# Altium schematic sheet 25 TEMPORARY DEVIATIONS.SchDoc
size 513 x 386 mm
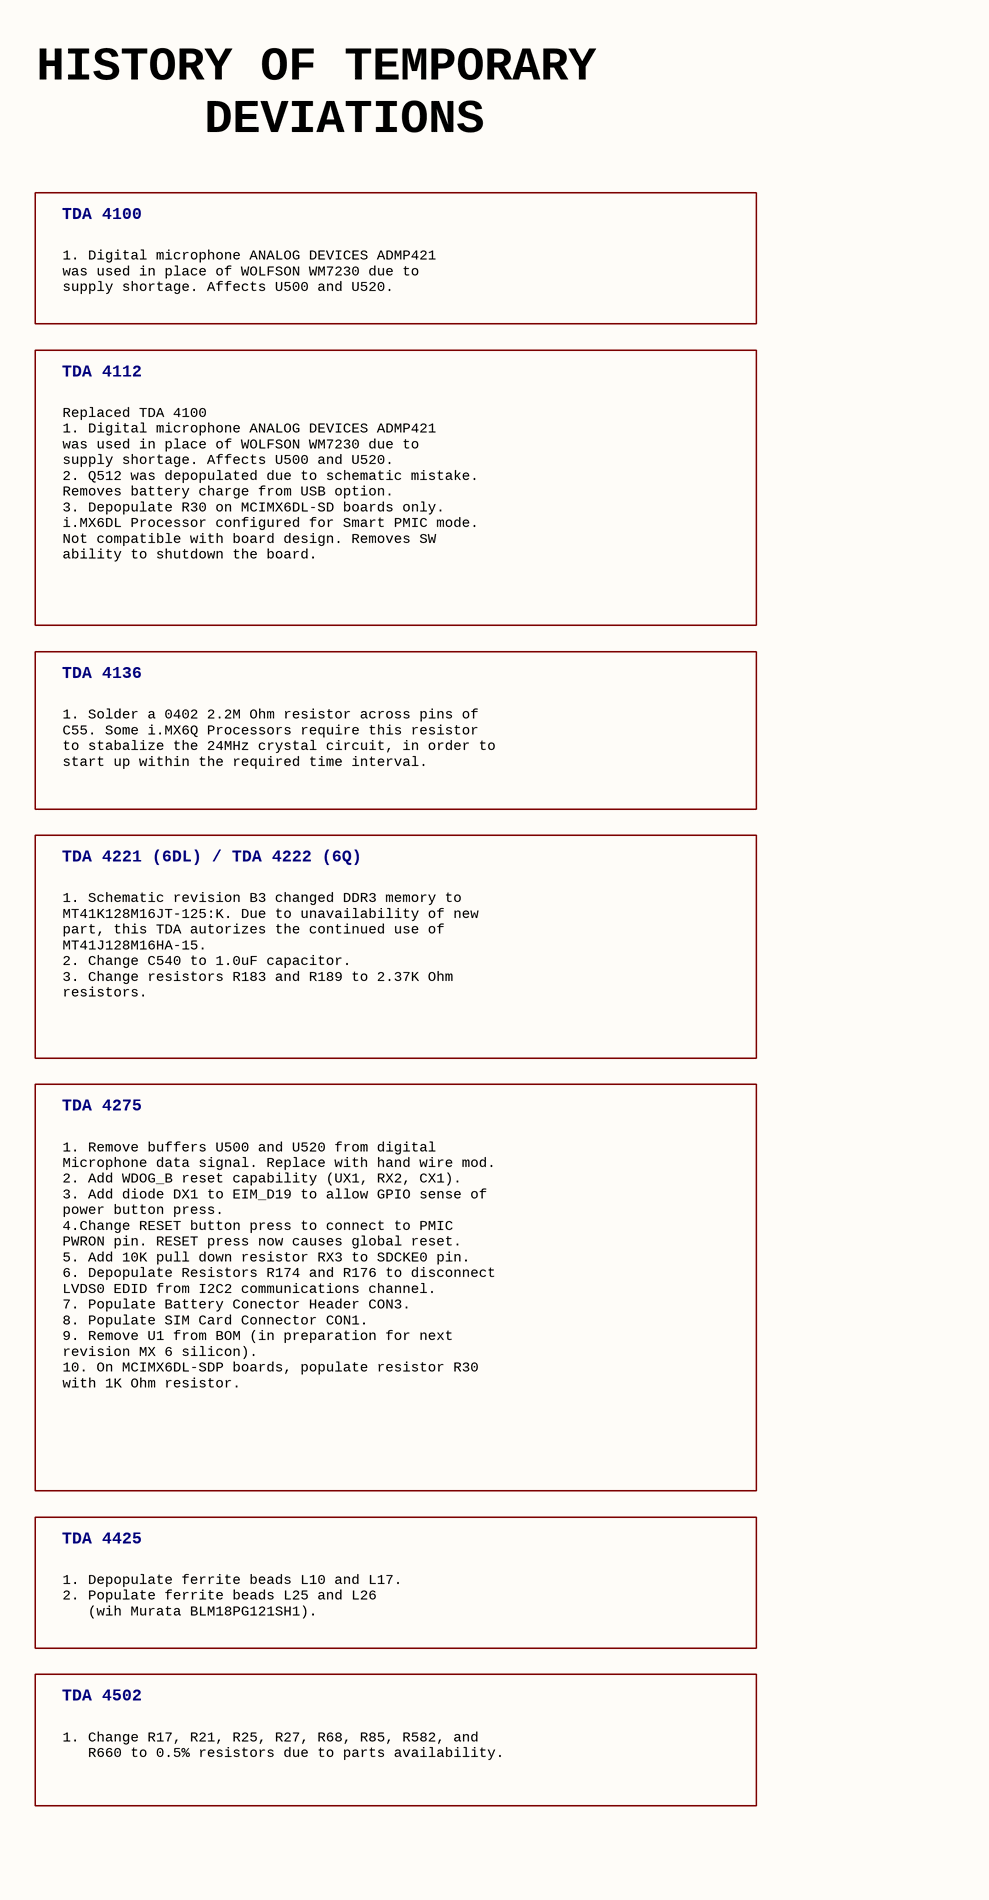
[diagram p0: 25 TEMPORARY DEVIATIONS.SchDoc, left]
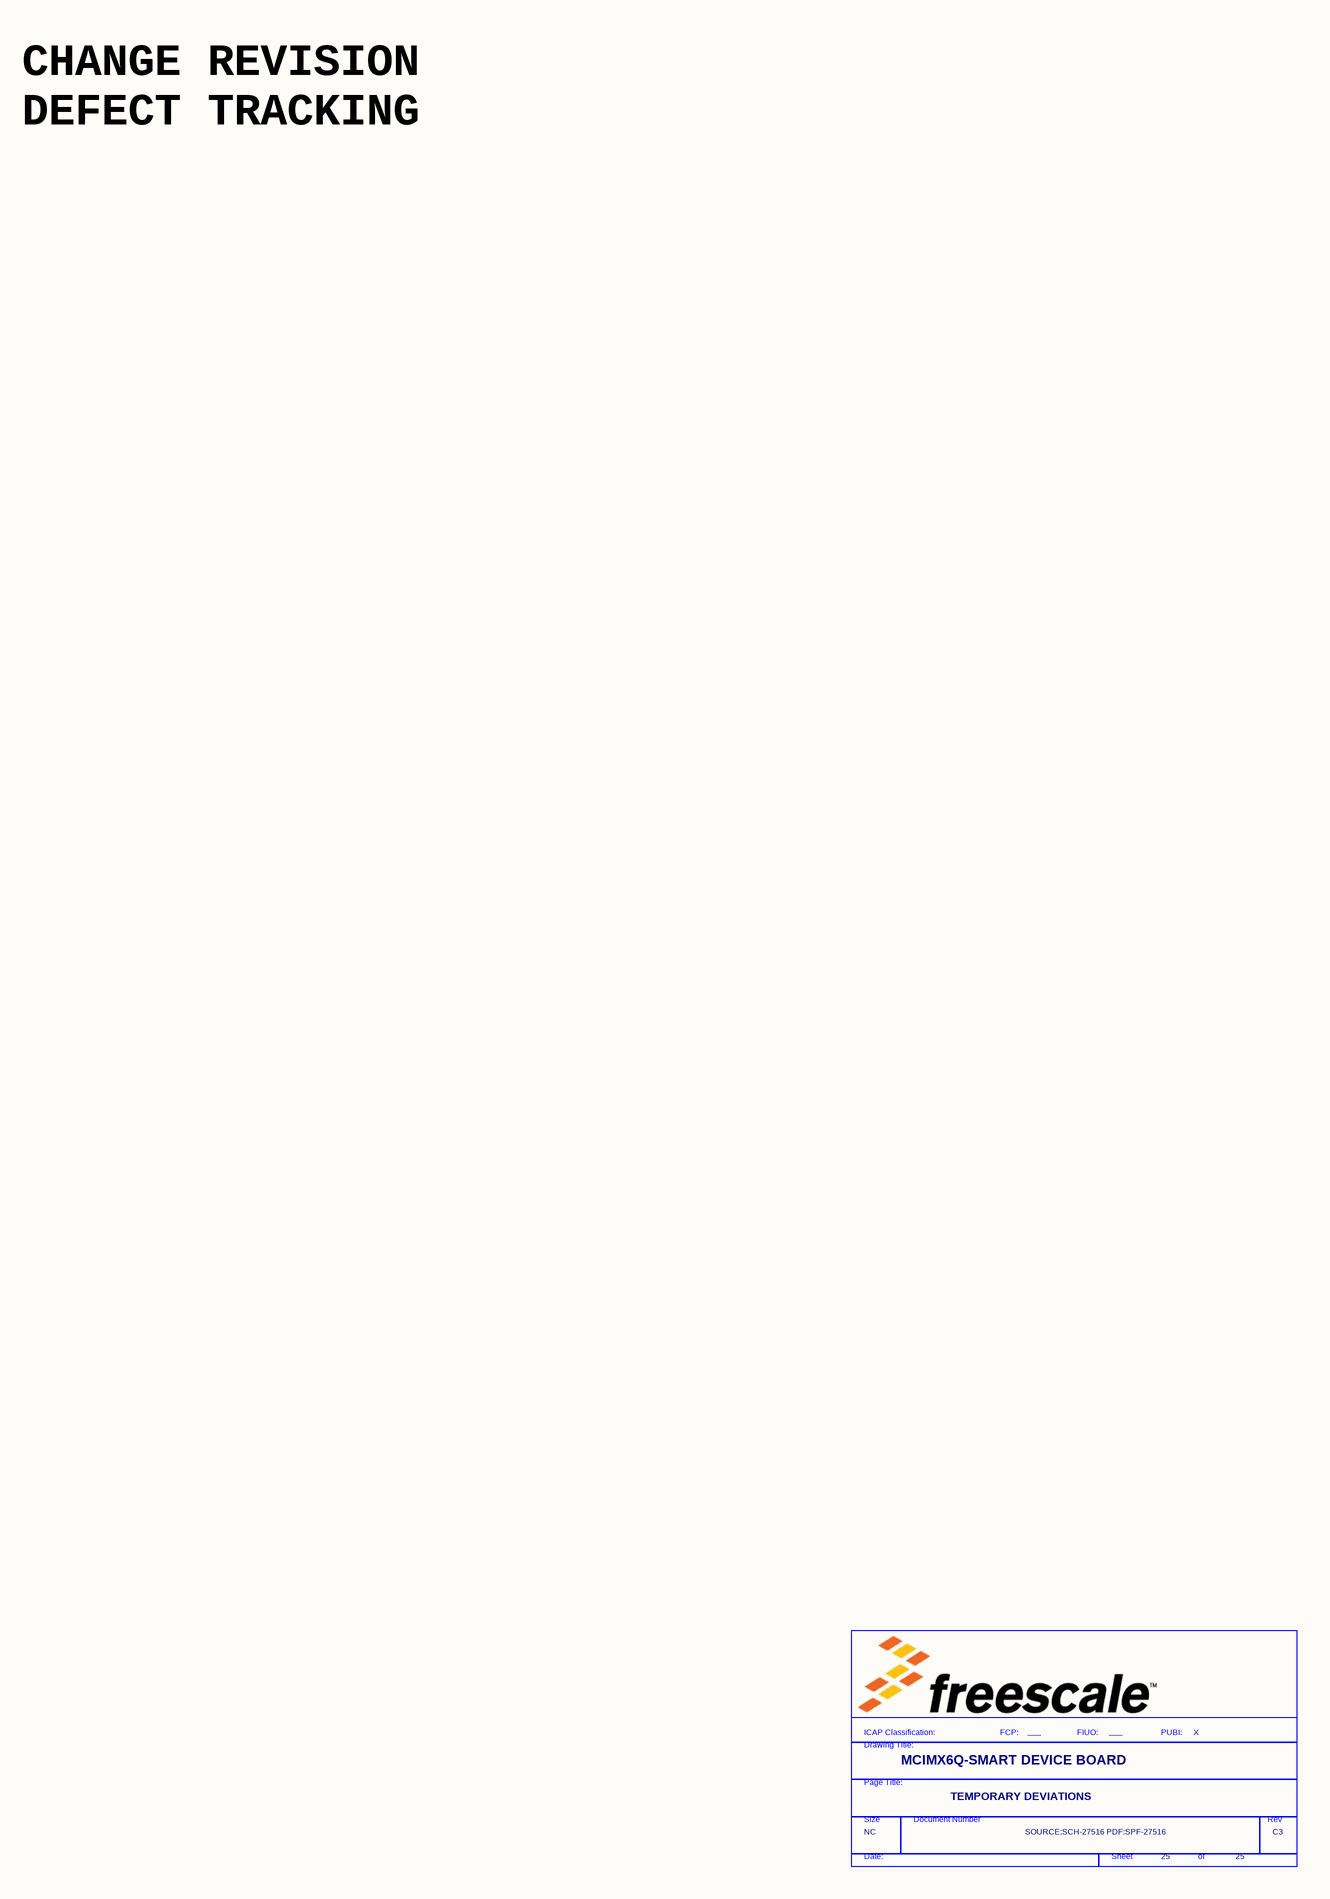
[diagram p1: 25 TEMPORARY DEVIATIONS.SchDoc, right]

## Parts
*  FIUO: ___  PUBI: X  Doc: SOURCE:SCH-27516 PDF:SPF-27516  RevCode: C3  Title: MCIMX6Q-SMART DEVICE BOARD  Page Size: NC  Page Number: 25  PageTitle: TEMPORARY DEVIATIONS  (hidden comment: TitleBlock_FS)  (graphical)

## Notes on the sheet
- HISTORY OF TEMPORARY
  DEVIATIONS
- CHANGE REVISION
  DEFECT TRACKING
- TDA 4100
- 1. Digital microphone ANALOG DEVICES ADMP421
  was used in place of WOLFSON WM7230 due to
  supply shortage. Affects U500 and U520.
- TDA 4112
- Replaced TDA 4100
  1. Digital microphone ANALOG DEVICES ADMP421
  was used in place of WOLFSON WM7230 due to
  supply shortage. Affects U500 and U520.
  2. Q512 was depopulated due to schematic mistake.
  Removes battery charge from USB option.
  3. Depopulate R30 on MCIMX6DL-SD boards only.
  i.MX6DL Processor configured for Smart PMIC mode.
  Not compatible with board design. Removes SW
  ability to shutdown the board.
- TDA 4136
- 1. Solder a 0402 2.2M Ohm resistor across pins of
  C55. Some i.MX6Q Processors require this resistor
  to stabalize the 24MHz crystal circuit, in order to
  start up within the required time interval.
- TDA 4221 (6DL) / TDA 4222 (6Q)
- 1. Schematic revision B3 changed DDR3 memory to
  MT41K128M16JT-125:K. Due to unavailability of new
  part, this TDA autorizes the continued use of
  MT41J128M16HA-15.
  2. Change C540 to 1.0uF capacitor.
  3. Change resistors R183 and R189 to 2.37K Ohm
  resistors.
- TDA 4275
- 1. Remove buffers U500 and U520 from digital
  Microphone data signal. Replace with hand wire mod.
  2. Add WDOG_B reset capability (UX1, RX2, CX1).
  3. Add diode DX1 to EIM_D19 to allow GPIO sense of
  power button press.
  4.Change RESET button press to connect to PMIC
  PWRON pin. RESET press now causes global reset.
  5. Add 10K pull down resistor RX3 to SDCKE0 pin.
  6. Depopulate Resistors R174 and R176 to disconnect
  LVDS0 EDID from I2C2 communications channel.
  7. Populate Battery Conector Header CON3.
  8. Populate SIM Card Connector CON1.
  9. Remove U1 from BOM (in preparation for next
  revision MX 6 silicon).
  10. On MCIMX6DL-SDP boards, populate resistor R30
  with 1K Ohm resistor.
- TDA 4425
- 1. Depopulate ferrite beads L10 and L17.
  2. Populate ferrite beads L25 and L26
  (wih Murata BLM18PG121SH1).
- TDA 4502
- 1. Change R17, R21, R25, R27, R68, R85, R582, and
  R660 to 0.5% resistors due to parts availability.
- (in symbol TitleBlock_FS) ICAP Classification:; FCP:; FIUO:; PUBI:; Drawing Title:; Page Title:; Size; Document Number; Rev; Date:; Sheet; of

## Library data of the parts
* = TitleBlock_FS: OrgAddr2: Austin, TX 78735-8598; OrgAddr1: 6501 William Cannon Drive West; OrgName: Freescale Semiconductor; FCP: ___; Page Create Date: March  8, 1995; Page Count: 25